# Altium schematic sheet RSV.SchDoc
size A4
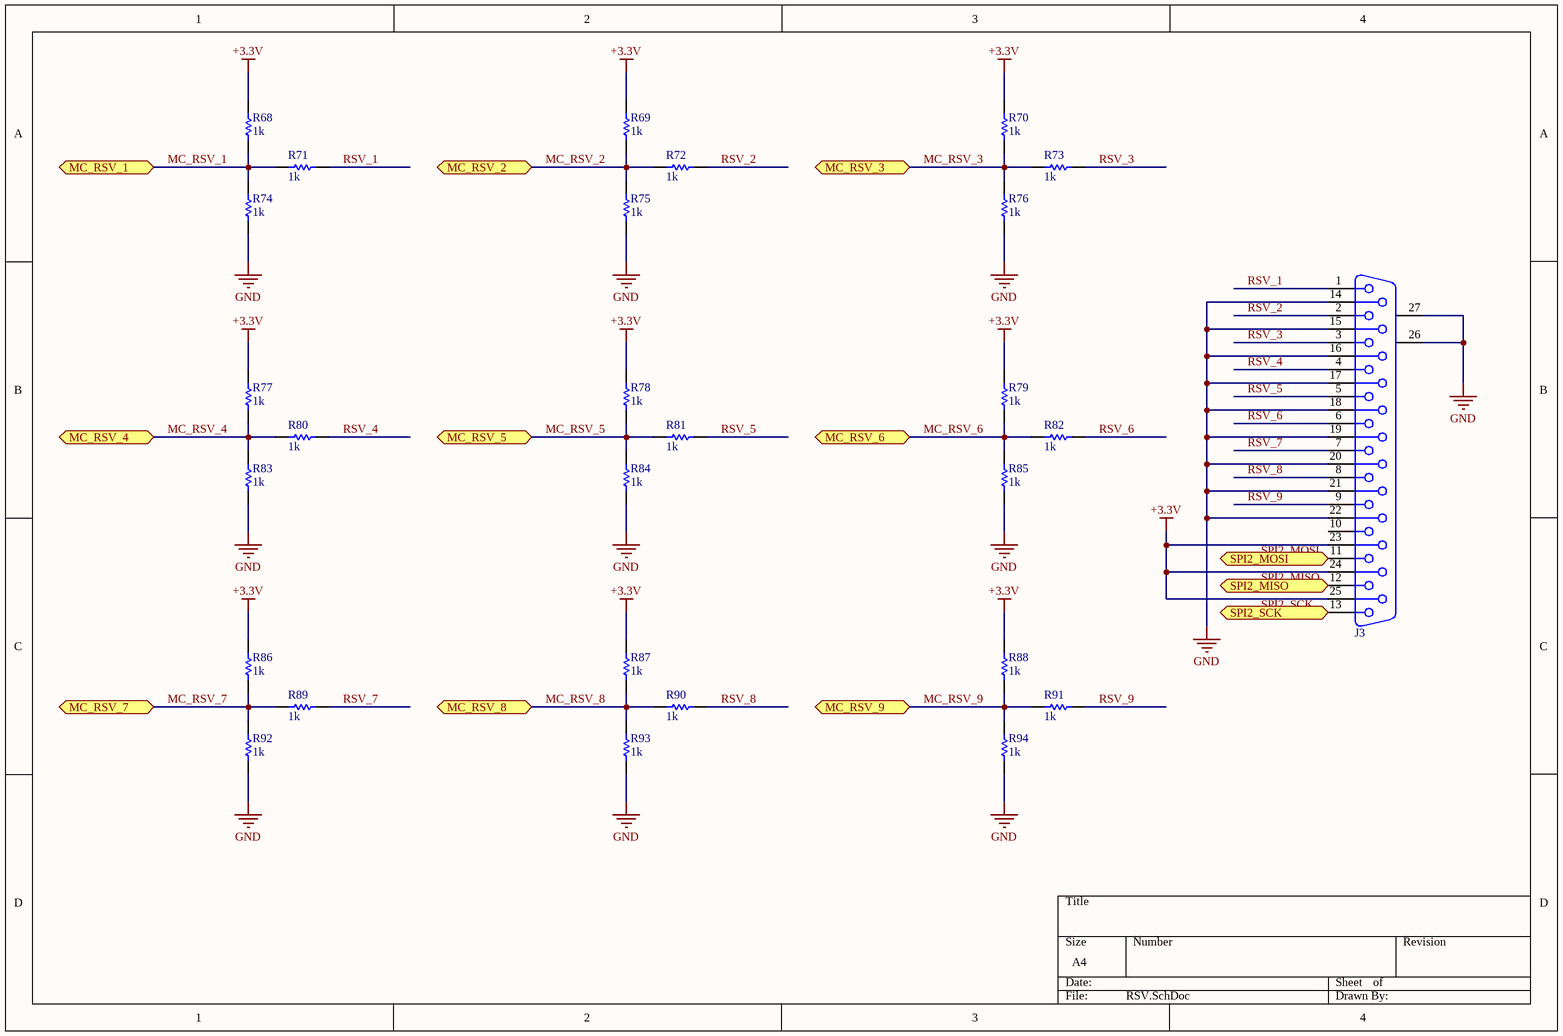
[diagram p0: RSV.SchDoc]

## Parts
J3  DB25_Straight  [DB25_Straight]  (value not drawn)
R68  value 1k  [R-805]  (hidden comment: R-805)
R69  value 1k  [R-805]  (hidden comment: R-805)
R70  value 1k  [R-805]  (hidden comment: R-805)
R71  value 1k  [R-805]  (hidden comment: R-805)
R72  value 1k  [R-805]  (hidden comment: R-805)
R73  value 1k  [R-805]  (hidden comment: R-805)
R74  value 1k  [R-805]  (hidden comment: R-805)
R75  value 1k  [R-805]  (hidden comment: R-805)
R76  value 1k  [R-805]  (hidden comment: R-805)
R77  value 1k  [R-805]  (hidden comment: R-805)
R78  value 1k  [R-805]  (hidden comment: R-805)
R79  value 1k  [R-805]  (hidden comment: R-805)
R80  value 1k  [R-805]  (hidden comment: R-805)
R81  value 1k  [R-805]  (hidden comment: R-805)
R82  value 1k  [R-805]  (hidden comment: R-805)
R83  value 1k  [R-805]  (hidden comment: R-805)
R84  value 1k  [R-805]  (hidden comment: R-805)
R85  value 1k  [R-805]  (hidden comment: R-805)
R86  value 1k  [R-805]  (hidden comment: R-805)
R87  value 1k  [R-805]  (hidden comment: R-805)
R88  value 1k  [R-805]  (hidden comment: R-805)
R89  value 1k  [R-805]  (hidden comment: R-805)
R90  value 1k  [R-805]  (hidden comment: R-805)
R91  value 1k  [R-805]  (hidden comment: R-805)
R92  value 1k  [R-805]  (hidden comment: R-805)
R93  value 1k  [R-805]  (hidden comment: R-805)
R94  value 1k  [R-805]  (hidden comment: R-805)

## Ports
MC_RSV_1, MC_RSV_2, MC_RSV_3, MC_RSV_4, MC_RSV_5, MC_RSV_6, MC_RSV_7, MC_RSV_8, MC_RSV_9, SPI2_MISO, SPI2_MOSI, SPI2_SCK

## Nets
+3.3V: J3.23 J3.24 J3.25 R68.2 R69.2 R70.2 R77.2 R78.2 R79.2 R86.2 R87.2 R88.2
GND: J3.14 J3.15 J3.16 J3.17 J3.18 J3.19 J3.20 J3.21 J3.22 J3.26(MH1) J3.27(MH2) R74.1 R75.1 R76.1 R83.1 R84.1 R85.1 R92.1 R93.1 R94.1
MC_RSV_1: R68.1 R71.2 R74.2 ; port MC_RSV_1
MC_RSV_2: R69.1 R72.2 R75.2 ; port MC_RSV_2
MC_RSV_3: R70.1 R73.2 R76.2 ; port MC_RSV_3
MC_RSV_4: R77.1 R80.2 R83.2 ; port MC_RSV_4
MC_RSV_5: R78.1 R81.2 R84.2 ; port MC_RSV_5
MC_RSV_6: R79.1 R82.2 R85.2 ; port MC_RSV_6
MC_RSV_7: R86.1 R89.2 R92.2 ; port MC_RSV_7
MC_RSV_8: R87.1 R90.2 R93.2 ; port MC_RSV_8
MC_RSV_9: R88.1 R91.2 R94.2 ; port MC_RSV_9
RSV_1: J3.1 R71.1
RSV_2: J3.2 R72.1
RSV_3: J3.3 R73.1
RSV_4: J3.4 R80.1
RSV_5: J3.5 R81.1
RSV_6: J3.6 R82.1
RSV_7: J3.7 R89.1
RSV_8: J3.8 R90.1
RSV_9: J3.9 R91.1
SPI2_MISO: J3.12 ; port SPI2_MISO
SPI2_MOSI: J3.11 ; port SPI2_MOSI
SPI2_SCK: J3.13 ; port SPI2_SCK

Not connected (* = marked no-connect by the designer): J3 10

## Notes on the sheet
- Labels drawn without touching a wire or pin: SPI2_MISO, SPI2_MOSI, SPI2_SCK

## Library data of the parts
J3 = DB25_Straight: Receptacle Assembly, 25 Position, Right Angle; PackageDocument: U; Positions: 25; Published: 15-Jun-2001; LatestRevisionDate: 17-Jul-2002; LatestRevisionNote: Re-released for DXP Platform.; DatasheetDocument: 19-Mar-1999; PackageReference: 787202; Publisher: Altium Limited; Orientation: Right Angle; Gender: Receptacle
R68-R94 = R-805: Resistor